# EAGLE design UniversalSaftSwitch (EAGLE 6.5.0)
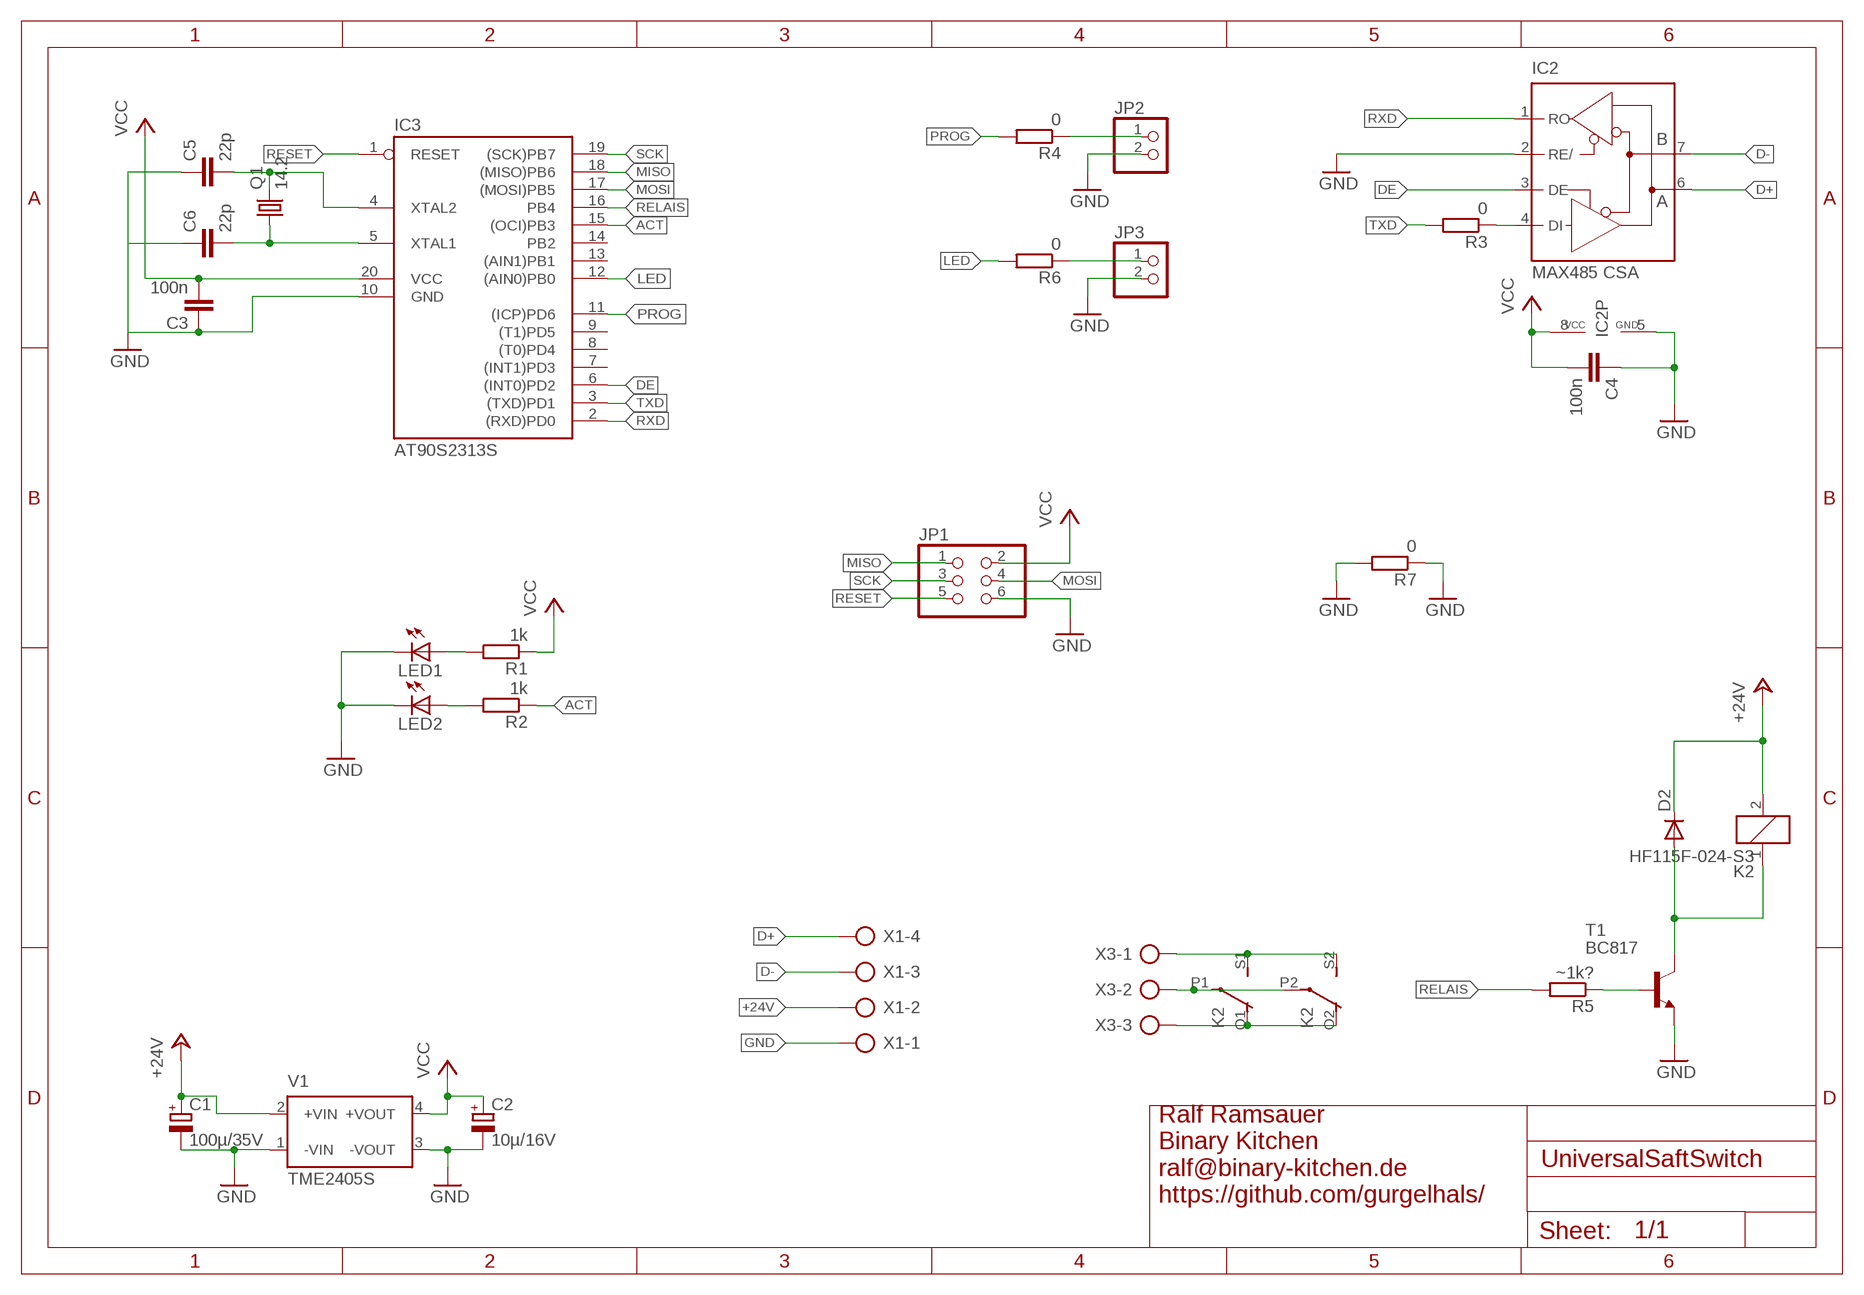
[diagram p0: schematic, sheet 1]

## Parts
C1  100µ/35V  CPOL-EUE3.5-8  [E3,5-8]
C2  10µ/16V  CPOL-EUE2-4  [E2-4]
C3  100n  C-EUC0805K  [C0805K]
C4  100n  C-EUC0805K  [C0805K]
C5  22p  C-EUC0805K  [C0805K]
C6  22p  C-EUC0805K  [C0805K]
D2  DIODE-MINIMELF  [MINIMELF]
IC2  MAX485 CSA  MAX481CSA  [SO08]
IC3  AT90S2313S  [SO20L]
JP1  PINHD-2X3  [2X03]
JP2  PINHD-1X2  [1X02]
JP3  PINHD-1X2  [1X02]
K2  HF115F-024-S3  4052  [F4052]
LED1  LED3MM  [LED3MM]
LED2  LED3MM  [LED3MM]
Q1  14.2  CRYSTALHC49U-V  [HC49U-V]
R1  1k  R-EU_M0805  [M0805]
R2  1k  R-EU_M0805  [M0805]
R3  0  R-EU_M0805  [M0805]
R4  0  R-EU_M0805  [M0805]
R5  ~1k?  R-EU_M0805  [M0805]
R6  0  R-EU_M0805  [M0805]
R7  0  R-EU_M0805  [M0805]
T1  BC817  BC817-16-NPN-SOT23-BEC  [SOT23-BEC]
V1  TME2405S  [TME-24V]
X1  AK500/4  [AK500/4]
X3  AK500/3  [AK500/3]

## Nets
+24V: C1.+ D2.C K2.2 V1.2(+VIN) X1.2
ACT: IC3.15((OCI)PB3) R2.1
D+: IC2.6(A) X1.4
D-: IC2.7(B) X1.3
DE: IC2.3(DE) IC3.6((INT0)PD2)
GND: C1.- C2.- C3.1 C4.1 C5.1 C6.1 IC2.2(RE/) IC2.5(GND) IC3.10(GND) JP1.6 JP2.2 JP3.2 LED1.K(C) LED2.K(C) R7.1 R7.2 T1.E V1.1(-VIN) V1.3(-VOUT) X1.1
LED: IC3.12((AIN0)PB0) R6.2
MISO: IC3.18((MISO)PB6) JP1.1
MOSI: IC3.17((MOSI)PB5) JP1.4
N$1: IC2.4(DI) R3.1
N$2: LED1.A R1.2
N$3: LED2.A R2.2
N$4: K2.S1(2:S) K2.S2(3:S) X3.1
N$5: K2.O1(2:O) K2.O2(3:O) X3.3
N$6: K2.P1(2:P) K2.P2(3:P) X3.2
N$7: C5.2 IC3.4(XTAL2) Q1.2
N$8: D2.A K2.1 T1.C
N$9: R5.1 T1.B
N$10: C6.2 IC3.5(XTAL1) Q1.1
N$11: JP2.1 R4.1
N$12: JP3.1 R6.1
PROG: IC3.11((ICP)PD6) R4.2
RELAIS: IC3.16(PB4) R5.2
RESET: IC3.1(RESET) JP1.5
RXD: IC2.1(RO) IC3.2((RXD)PD0)
SCK: IC3.19((SCK)PB7) JP1.3
TXD: IC3.3((TXD)PD1) R3.2
VCC: C2.+ C3.2 C4.2 IC2.8(VCC) IC3.20(VCC) JP1.2 R1.1 V1.4(+VOUT)
Unconnected: IC3.7((INT1)PD3) IC3.8((T0)PD4) IC3.9((T1)PD5) IC3.13((AIN1)PB1) IC3.14(PB2)

## Notes on the sheet
- Ralf Ramsauer
  Binary Kitchen
  ralf@binary-kitchen.de
  https://github.com/gurgelhals/

## Library data of the parts
C1 C2 = rcl:CPOL-EU: POLARIZED CAPACITOR, European symbol
C3-C6 = rcl:C-EU: CAPACITOR, European symbol
D2 = diode:DIODE-: DIODE
IC2 = maxim:MAX481CSA: RS485 TRANSEIVER
IC3 = atmel:AT90S2313: MICROCONTROLLER 2 Kbytes FLASH 128 bytes SRAM 128 bytes EEPROM UART; OC_FARNELL: unknown; OC_NEWARK: unknown
JP1 = pinhead:PINHD-2X3: PIN HEADER
JP2 JP3 = pinhead:PINHD-1X2: PIN HEADER
K2 = relay:4052: RELAY 2 x switch, Finder; OC_FARNELL: unknown; OC_NEWARK: unknown
LED1 LED2 = led:LED: LED OSRAM: - CHIPLED LG R971, LG N971, LY N971, LG Q971, LY Q971, LO R971, LY R971 LH N974, LH R974 LS Q976, LO Q976, LY Q976 LO Q996 - Hyper CHIPLED LW Q18S LB Q993, LB Q99A, LB R99A - SideLED LS A670, LO A670, LY A670, LG A670, LP A670 LB A673, LV A673, LT A673, LW A673 LH A674 LY A675 LS A676, LA A676, LO A676, LY A676, LW A676 LS A679, LY A679, LG A679 - Hyper Micro SIDELED® LS Y876, LA Y876, LO Y876, LY Y876 LT Y87S - SmartLED LW L88C, LW L88S LB L89C, LB L89S, LG L890 LS L89K, LO L89K, LY L89K LS L896, LA L896, LO L896, LY L896 - TOPLED LS T670, LO T670, LY T670, LG T670, LP T670 LSG T670, LSP T670, LSY T670, LOP T670, LYG T670 LG T671, LOG T671, LSG T671 LB T673, LV T673, LT T673, LW T673 LH T674 LS T676, LA T676, LO T676, LY T676, LB T676, LH T676, LSB T676, LW T676 LB T67C, LV T67C, LT T67C, LS T67K, LO T67K, LY T67K, LW E67C LS E67B, LA E67B, LO E67B, LY E67B, LB E67C, LV E67C, LT E67C LW T67C LS T679, LY T679, LG T679 LS T770, LO T770, LY T770, LG T770, LP T770 LB T773, LV T773, LT T773, LW T773 LH T774 LS E675, LA E675, LY E675, LS T675 LS T776, LA T776, LO T776, LY T776, LB T776 LHGB T686 LT T68C, LB T68C - Hyper Mini TOPLED® LB M676 - Mini TOPLED Santana® LG M470 LS M47K, LO M47K, LY M47K Source: http://www.osram.convergy.de LUXEON: - LUMILED® LXK2-PW12-R00, LXK2-PW12-S00, LXK2-PW14-U00, LXK2-PW14-V00 LXK2-PM12-R00, LXK2-PM12-S00, LXK2-PM14-U00 LXK2-PE12-Q00, LXK2-PE12-R00, LXK2-PE12-S00, LXK2-PE14-T00, LXK2-PE14-U00 LXK2-PB12-K00, LXK2-PB12-L00, LXK2-PB12-M00, LXK2-PB14-N00, LXK2-PB14-P00, LXK2-PB14-Q00 LXK2-PR12-L00, LXK2-PR12-M00, LXK2-PR14-Q00, LXK2-PR14-R00 LXK2-PD12-Q00, LXK2-PD12-R00, LXK2-PD12-S00 LXK2-PH12-R00, LXK2-PH12-S00 LXK2-PL12-P00, LXK2-PL12-Q00, LXK2-PL12-R00 Source: www.luxeon.com KINGBRIGHT: KA-3528ASYC Source: www.kingbright.com
Q1 = crystal:CRYSTAL: CRYSTAL; OC_FARNELL: 1666969; OC_NEWARK: unknown
R1-R7 = rcl:R-EU_: RESISTOR, European symbol
T1 = transistor:*-NPN-: NPN Transistror BF959 corrected 2008.03.06
V1 = traco-electronic:TME?*: DC/DC Converter TME Series 1 Watt Source: www.tracopower.com .. tme.pdf; MPN: TME 2405S; OC_FARNELL: 1007547; OC_NEWARK: 51R5329
X1 = con-ptr500:AK500/4: CONNECTOR; OC_FARNELL: unknown; OC_NEWARK: unknown
X3 = con-ptr500:AK500/3: CONNECTOR; OC_FARNELL: unknown; OC_NEWARK: unknown

## Board
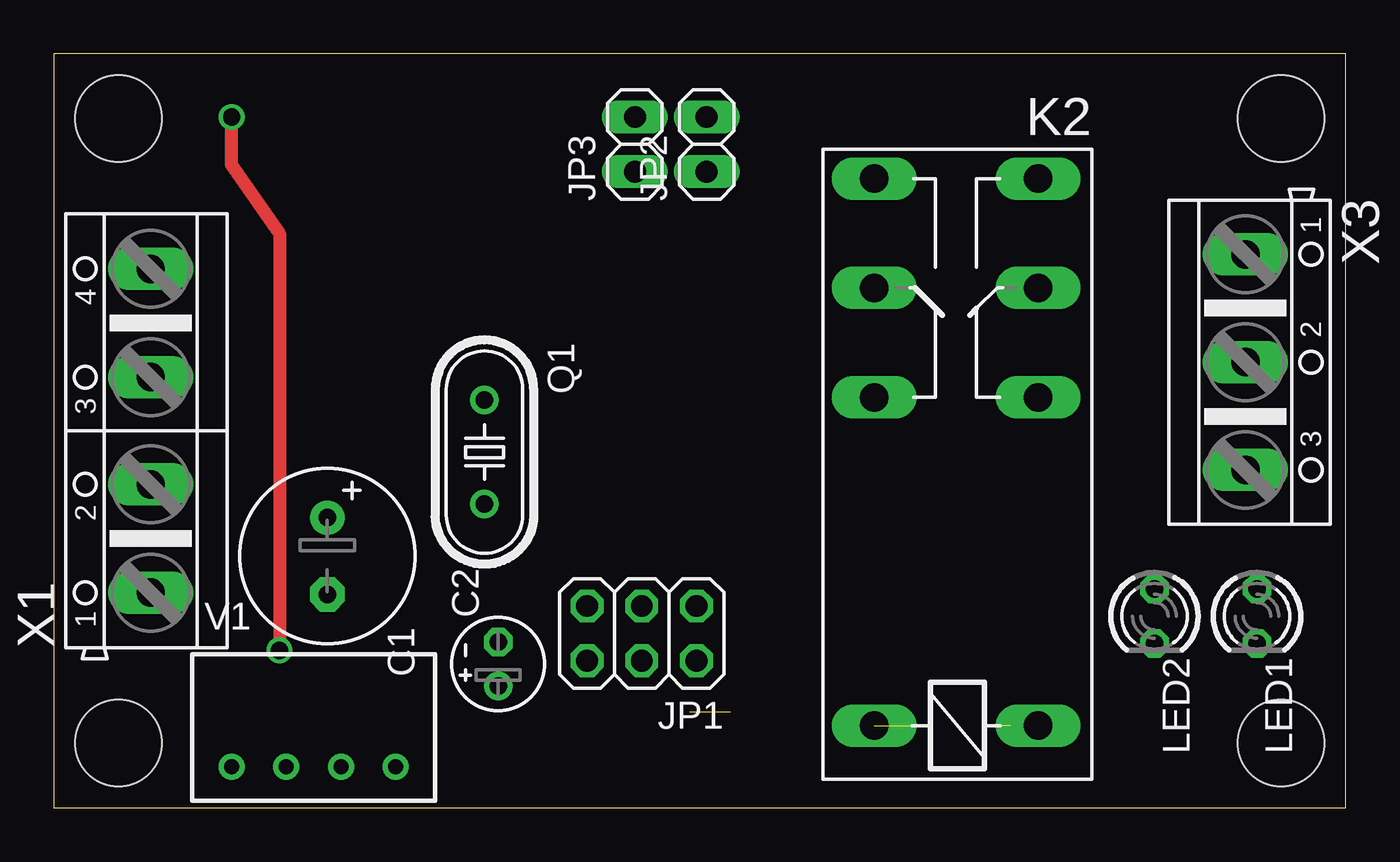
[diagram p1: board, top side]
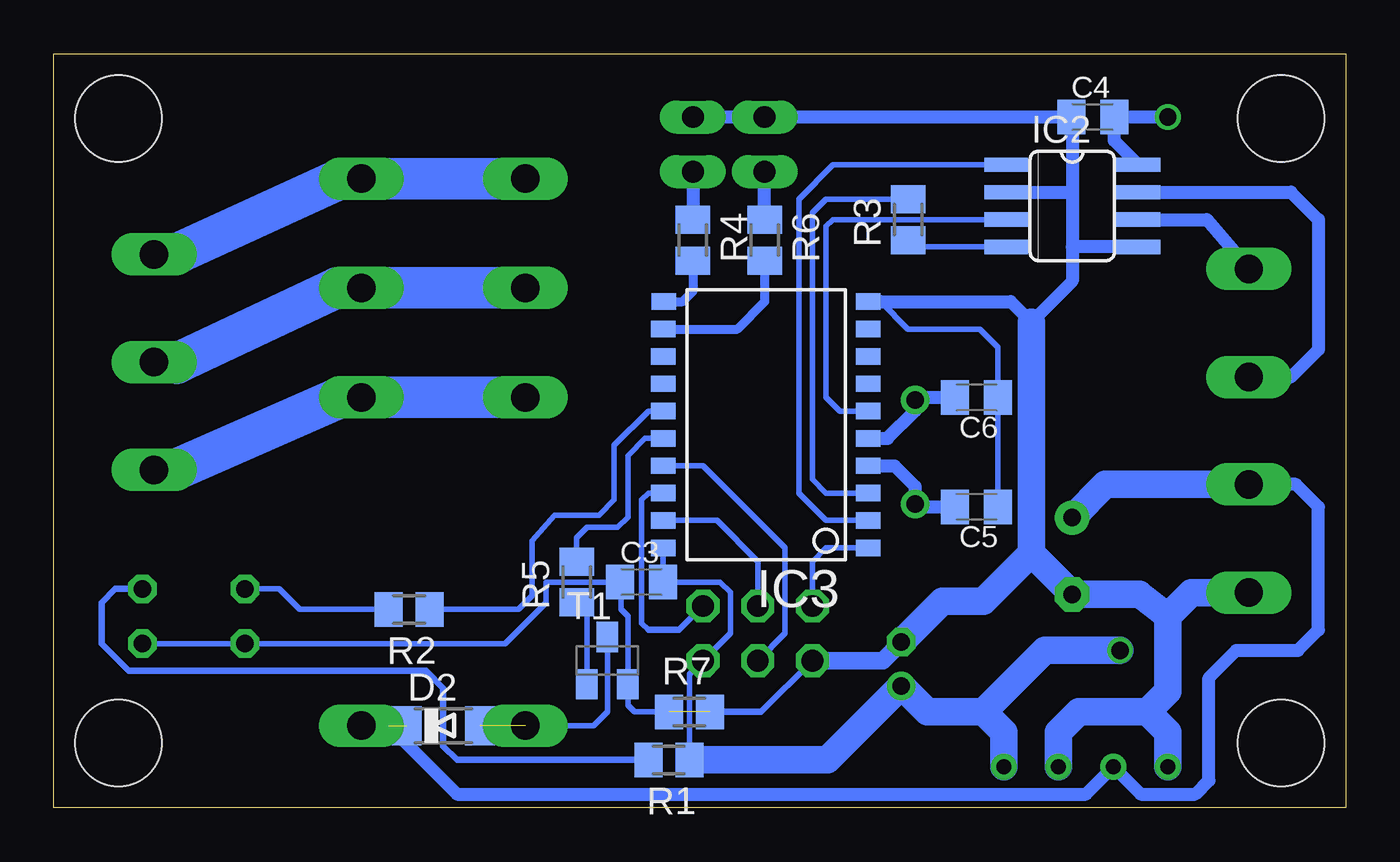
[diagram p2: board, bottom side, seen from below]

Size 60 x 35 mm. Coordinates in mm from the lower left corner, seen from the top.
Outline: 0,0 60,0 60,35 0,35 0,0
Copper layers (1*16): Top 0.035mm / dielectric 1.5mm / Bottom 0.035mm
Design rules "SeeedStudio_2layer_DRU_no_angle_20140221": minimum track width 6mil, minimum drill 12mil, track to track 6mil, track to pad 6mil, pad to pad 6mil, via to via 6mil, smd to smd 0mil, copper to edge 10mil, drill to drill 10mil, minimum pad ring 10mil, minimum via ring 6mil, stop-mask expansion 2mil, vias tented up to drill 100mil, thermal gap 10mil
Holes 4 mm at 3,3 3,32 57,32 57,3

### Footprints (pad centres in the part's own frame; a part is rotated, then mirrored left to right if it is on the bottom)
E3,5-8 = drill 0.813 pad 1.6: + -1.778,0 | drill 0.813 pad 1.6 octagon: - 1.778,0
E2-4 = drill 0.813 pad 1.27: + -1.016,0 | drill 0.813 pad 1.27 octagon: - 1.016,0
C0805K = smd 1.3 x 1.6: 1 -1,0; 2 1,0
MINIMELF = smd 1.4 x 1.8: A 1.7,0; C -1.7,0
SO08 = smd 0.66 x 2.032: 1 -1.905,-3.073; 2 -0.635,-3.073; 3 0.635,-3.073; 4 1.905,-3.073; 5 1.905,3.073; 6 0.635,3.073; 7 -0.635,3.073; 8 -1.905,3.073
SO20L = smd 0.762 x 1.143: 1 -5.08,-5.131; 2 -3.81,-5.131; 3 -2.54,-5.131; 4 -1.27,-5.131; 5 0,-5.131; 6 1.27,-5.131; 7 2.54,-5.131; 8 3.81,-5.131; 9 5.08,-5.131; 10 6.35,-5.131; 11 6.35,4.369; 12 5.08,4.394; 13 3.81,4.394; 14 2.54,4.394; 15 1.27,4.394; 16 0,4.394; 17 -1.27,4.394; 18 -2.54,4.394; 19 -3.81,4.394; 20 -5.08,4.394
2X03 = drill 1.016 octagon: 1 -2.54,-1.27; 2 -2.54,1.27; 3 0,-1.27; 4 0,1.27; 5 2.54,-1.27; 6 2.54,1.27
1X02 = drill 1.016 long: 1 -1.27,0; 2 1.27,0
F4052 = drill 1.321 long: 1 -3.81,3.81; 2 -3.81,-3.81; O1 11.43,-3.81; O2 11.43,3.81; P1 16.51,-3.81; P2 16.51,3.81; S1 21.59,-3.81; S2 21.59,3.81
LED3MM = drill 0.813 octagon: A -1.27,0; K 1.27,0
HC49U-V = drill 0.813: 1 -2.413,0; 2 2.413,0
M0805 = smd 1.3 x 1.6: 1 -0.95,0; 2 0.95,0
SOT23-BEC = smd 1 x 1.4: B -0.95,-1.1; C 0,1.1; E 0.95,-1.1
TME-24V = drill 0.7 pad 1.1: 1 -3.81,0; 2 -1.27,0; 3 1.27,0; 4 3.81,0
AK500/4 = drill 1.321 long: 1 -7.518,0; 2 -2.489,0; 3 2.489,0; 4 7.518,0
AK500/3 = drill 1.321 long: 1 -5.004,0; 2 0,0; 3 5.004,0

### Placement (x,y rotation side)
C1  12.7,11.68 270 top
C2  20.64,6.67 90 top
C3  32.7,10.48 0 bottom
C4  11.75,32.07 0 bottom
C5  17.14,13.97 180 bottom
C6  17.14,19.05 180 bottom
D2  41.91,3.81 0 bottom
IC2  12.7,27.94 270 bottom
IC3  27.3,17.14 90 bottom
JP1  27.3,8.1 180 top
JP2  30.32,30.8 90 top
JP3  26.99,30.8 90 top
K2  41.91,7.62 90 top
LED1  55.88,8.89 270 top
LED2  51.12,8.89 270 top
Q1  20,16.51 270 top
R1  31.43,2.22 180 bottom
R2  43.5,9.21 180 bottom
R3  20.32,27.3 90 bottom
R4  30.32,26.35 270 bottom
R5  35.72,10.48 90 bottom
R6  26.99,26.35 270 bottom
R7  30.48,4.45 0 bottom
T1  34.29,6.83 0 bottom
V1  12.06,1.91 0 top
X1  4.5,17.5 90 top
X3  55.34,20.68 270 top

### Tracks (layer width: path | path; a pad name or v marks a point on that pad's centre or on a via)
+24V  (1 unrouted)
  Bottom 0.61: K2.2 44.45,3.81 41.27,0.64 12.06,0.64 V1.2 9.53,0.64 6.99,0.64 6.35,1.27 6.35,6.03 5.08,7.3 2.22,7.3 1.27,8.26 1.27,13.97 2.31,15.01 X1.2
  Bottom 1.27: C1.+ 11.15,15.01 X1.2
ACT
  Bottom 0.254: IC3.15 32.38,18.41 33.97,16.83 33.97,14.29 34.69,13.57 36.75,13.57 37.78,12.38 37.78,9.84 38.42,9.21 R2.1
D+
  Bottom 0.61: IC2.6 6.45,27.3 X1.4
D-
  Bottom 0.61: IC2.7 2.54,28.57 1.27,27.3 1.27,21.27 2.55,19.99 X1.3
DE
  Bottom 0.254: IC3.6 23.5,18.41 24.13,19.05 24.13,26.99 23.81,27.3 IC2.3
GND  (1 unrouted)
  Bottom 0.254: LED1.K LED2.K 39.05,7.62 37.15,9.53 37.15,10.48 C3.1 33.66,10.43 33.66,9.21 33.34,8.89 T1.E 33.34,4.76 33.03,4.46 R7.1 | 21.59,23.5 20.32,22.23 16.99,22.23 16.14,21.38 C6.1 C5.1
  Bottom 0.305: R7.2 27.15,4.45 JP1.6 | R7.1
  Bottom 0.61: 12.7,28.57 12.7,26.04 | IC2.2 12.7,28.57 | IC2.5 12.7,26.04 | 12.7,28.57 12.7,32.02 C4.1 JP3.2 JP2.2 | IC3.10 21.59,23.5 15.56,23.5 14.61,22.54 12.7,24.45 12.7,26.04
  Bottom 0.813: JP1.6 21.5,6.83 C2.-
  Bottom 1.27: X1.1 7.16,9.98 8.26,8.89 | 8.26,8.89 9.59,9.91 C1.- 14.61,11.81 | 14.61,22.54 14.61,11.81 | 14.61,11.81 16.83,9.59 18.73,9.59 C2.- | 8.26,8.89 8.26,5.4 9.21,4.45 | 9.21,4.45 8.26,3.49 V1.1 | V1.3 13.34,3.49 12.38,4.45 9.21,4.45
LED
  Bottom 0.406: R6.2 26.99,23.5 28.26,22.23 IC3.12
MISO
  Bottom 0.254: IC3.18 32.38,14.61 32.7,14.29 32.7,8.57 32.38,8.26
  Bottom 0.305: 32.38,8.26 30.96,8.26 JP1.1
MOSI
  Bottom 0.254: IC3.17 29.84,15.88 26.04,12.06 26.04,8.1 JP1.4
N$1
  Bottom 0.254: 20,26.04 IC2.4
  Bottom 0.305: R3.1 20,26.04
N$2
  Bottom 0.305: LED1.A 57.15,10.16 57.78,9.53 57.78,7.62 56.52,6.35 42.7,6.35 41.91,5.56 41.91,2.86 41.27,2.22 R1.2
N$3
  Bottom 0.254: LED2.A 49.53,10.16 48.58,9.21 R2.2
N$4
  Bottom 1.93: K2.S2 K2.S1 46.67,29.21 54.29,25.72 X3.1
N$5
  Bottom 1.93: K2.O2 K2.O1 46.67,19.05 54.29,15.72 X3.3
N$6
  Bottom 1.93: K2.P2 K2.P1 46.83,24.13 54.29,20.64 X3.2
N$7
  Bottom 0.61: IC3.4 20.95,15.88 20,14.92 Q1.2 19.88,13.97 C5.2
N$8  (1 unrouted)
  Bottom 0.254: K2.1 34.92,3.81 34.29,4.45 T1.C
N$9
  Bottom 0.254: T1.B 35.24,8.89 R5.1
N$10
  Bottom 0.61: IC3.5 21.27,17.14 20,18.41 Q1.1 19.88,19.05 C6.2
N$11
  Bottom 0.61: JP2.1 R4.1
N$12
  Bottom 0.61: R6.1 JP3.1
PROG
  Bottom 0.406: IC3.11 30.8,23.5 30.32,23.97 R4.2
RELAIS
  Bottom 0.254: IC3.16 32.54,17.14 33.34,16.35 33.34,13.49 33.81,13.02 35.24,13.02 35.72,12.54 R5.2
RESET
  Bottom 0.254: IC3.1 24.13,12.06 24.77,11.43 JP1.5
RXD
  Bottom 0.254: IC3.2 24.13,13.34 25.4,14.61 25.4,28.26 23.81,29.84 IC2.1
SCK
  Bottom 0.254: IC3.19 29.21,13.34 27.3,11.43 JP1.3
TXD
  Bottom 0.254: R3.2 24.13,28.25 24.77,27.62 24.77,15.24 24.13,14.61 IC3.3
VCC  (via drill 0.8)
  Top 0.61: v10.48,7.3 10.48,26.67 8.26,29.84 v8.26,32.07
  Bottom 0.254: IC3.20 C3.2 29.05,10.48 28.57,10 28.57,8.1 JP1.2 30.48,6.19 30.48,2.54
  Bottom 0.61: IC2.8 10.75,30.97 C4.2 v8.26,32.07 | R1.1 30.48,2.54
  Bottom 1.27: V1.4 15.88,3.49 16.83,4.45 | 16.83,4.45 19.43,4.45 C2.+ 24.07,2.22 R1.1 | 16.83,4.45 13.97,7.3 v10.48,7.3